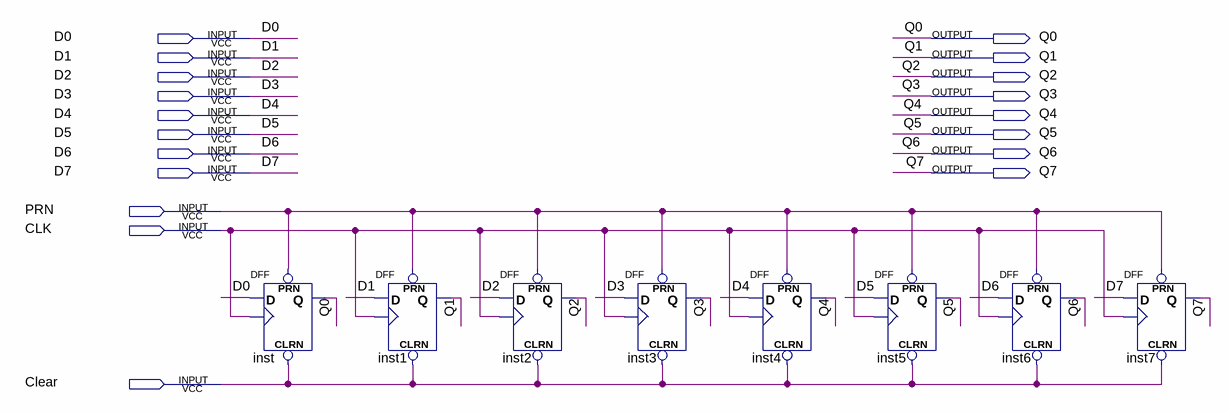
[diagram p0: schematic sheet]
// Quartus schematic 8BitRegister.bdf as structural Verilog: 8 symbols, 19 pins
module \8BitRegister  (
  input  D0,
  input  D1,
  input  D2,
  input  D3,
  input  D4,
  input  D5,
  input  D6,
  input  D7,
  input  PRN,
  input  CLK,
  input  Clear,
  output Q0,
  output Q1,
  output Q2,
  output Q3,
  output Q4,
  output Q5,
  output Q6,
  output Q7
);

  DFF inst (.CLRN(Clear), .CLK(CLK), .D(D0), .PRN(PRN), .Q(Q0));
  DFF inst1 (.CLRN(Clear), .CLK(CLK), .D(D1), .PRN(PRN), .Q(Q1));
  DFF inst2 (.CLRN(Clear), .CLK(CLK), .D(D2), .PRN(PRN), .Q(Q2));
  DFF inst3 (.CLRN(Clear), .CLK(CLK), .D(D3), .PRN(PRN), .Q(Q3));
  DFF inst4 (.CLRN(Clear), .CLK(CLK), .D(D4), .PRN(PRN), .Q(Q4));
  DFF inst5 (.CLRN(Clear), .CLK(CLK), .D(D5), .PRN(PRN), .Q(Q5));
  DFF inst6 (.CLRN(Clear), .CLK(CLK), .D(D6), .PRN(PRN), .Q(Q6));
  DFF inst7 (.CLRN(Clear), .CLK(CLK), .D(D7), .PRN(PRN), .Q(Q7));
endmodule
